# Altium schematic sheet Power_SCH.SchDoc: АСУН-1
size 420 x 297 mm; ApprovedBy: Мешков; CheckedBy: Мешков; Author: Самойлов; CompanyName: РГППУ; DocumentNumber: 2; SheetNumber: 2; SheetTotal: 2; DecimalNumber: ЛТФ.15.01 Э3
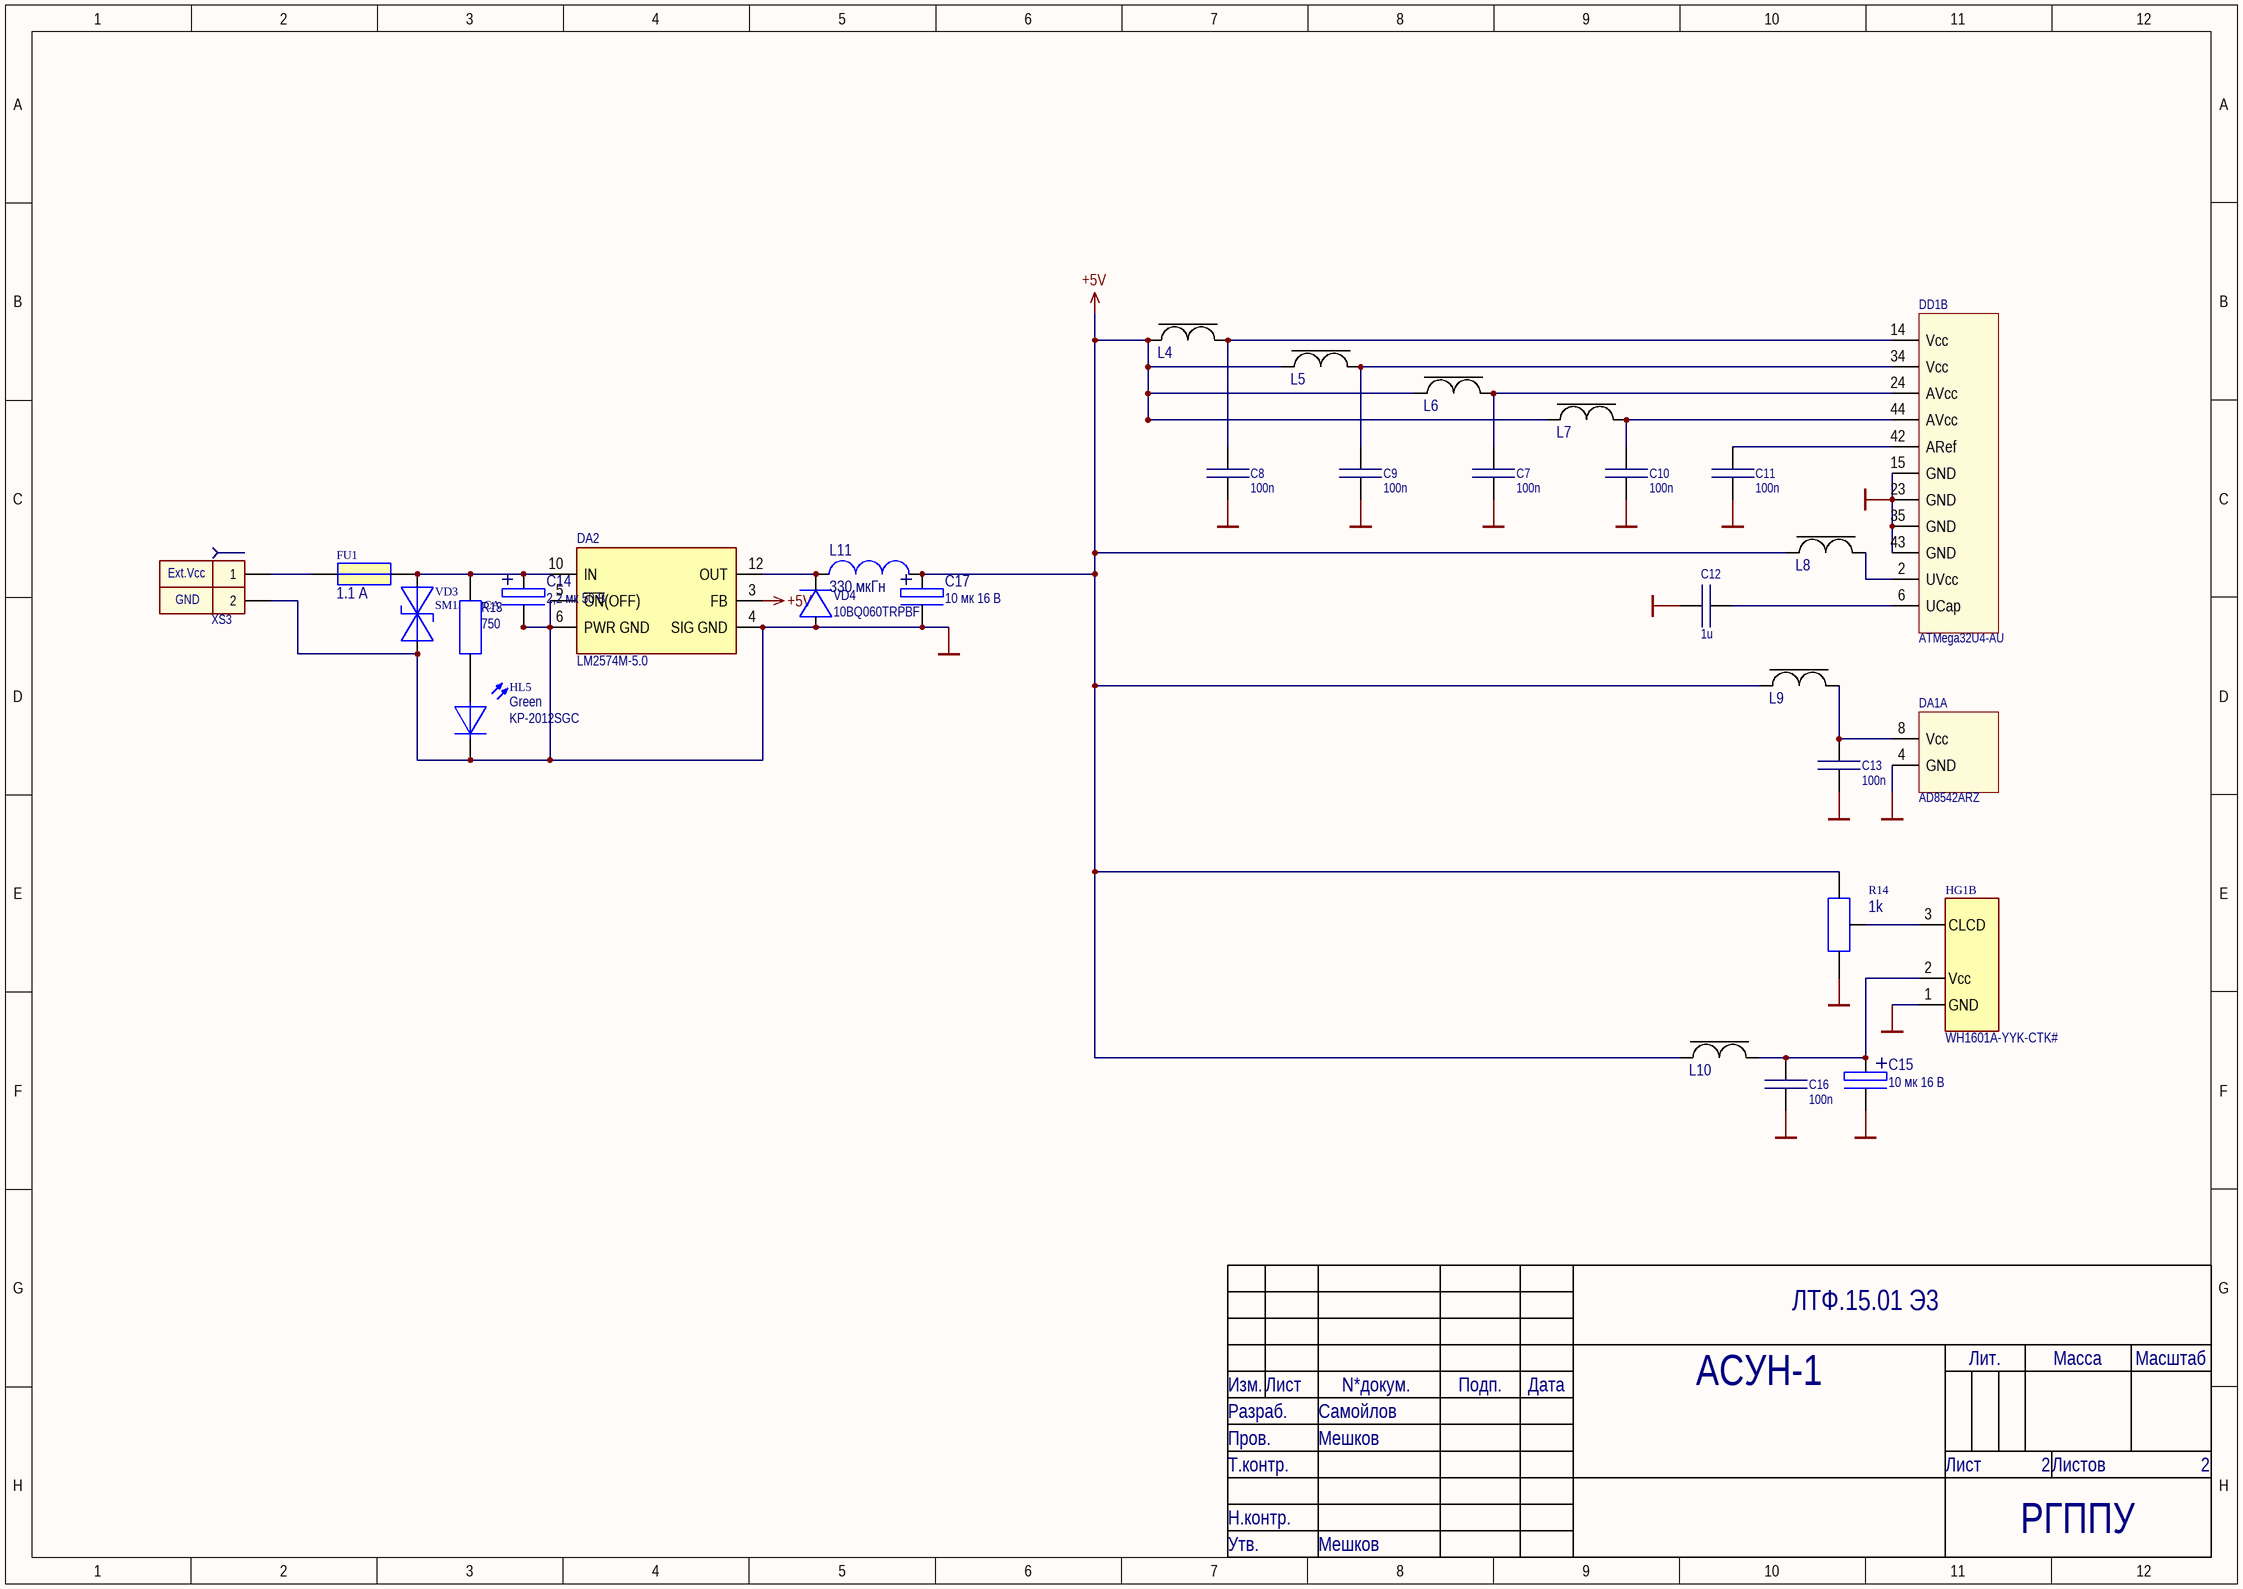
[diagram p0: Power_SCH.SchDoc]

## Parts
C7  100n  [SMDRC0805]
C8  100n  [SMDRC0805]
C9  100n  [SMDRC0805]
C10  100n  [SMDRC0805]
C11  100n  [SMDRC0805]
C12  1u  [SMDRC0805]
C13  100n  [SMDRC0805]
C14  value 2,2 мк 50 В  [CAP_POLAR_ELLYTE_B]  (hidden comment: CA050M2R20REB-0405)
C15  value 10 мк 16 В  [CAP_POLAR_ELLYTE_B]  (hidden comment: CA016M0010REB-0405)
C16  100n  [SMDRC0805]
C17  value 10 мк 16 В  [CAP_POLAR_ELLYTE_B]  (hidden comment: CA016M0010REB-0405)
DA1  AD8542ARZ  [AD8542ARZ]  (part A of 3)
DA2  LM2574M-5.0  [SOIC127P1030X264-14M]
DD1  ATMega32U4-AU  [44ML_L]  (part B of 3)
FU1  value 1.1 А  [EFuse 1.1A]  (hidden comment: EFuse LP60-110F)
HG1  WH1601A-YYK-CTK#  [WH1601A]  (part B of 2)
HL5  Green  ManufacturerPartNumber: KP-2012SGC  [DIOMELF2012M]
L4  MPZ1608S181A  [INDC0603X03M]  (value not drawn)
L5  MPZ1608S181A  [INDC0603X03M]  (value not drawn)
L6  MPZ1608S181A  [INDC0603X03M]  (value not drawn)
L7  MPZ1608S181A  [INDC0603X03M]  (value not drawn)
L8  MPZ1608S181A  [INDC0603X03M]  (value not drawn)
L9  MPZ1608S181A  [INDC0603X03M]  (value not drawn)
L10  MPZ1608S181A  [INDC0603X03M]  (value not drawn)
L11  value 330 мкГн  [INDP7972X50M]  (hidden comment: SCD0705T-331K-N)
R13  750  [SMDRC0805]
R14  value 1k  [T93YA]  (hidden comment: T93YA102KT20)
VD3  SM15T12CA  [SUPRES3216X18N]
VD4  10BQ060TRPBF  [SHOTKY 4.1x3.3]
XS3  330-031-12  [330-031-12]  (value not drawn)

## Nets
+5V: C17.2(+) DA2.3(FB) L4.2 L5.2 L6.2 L7.2 L8.2 L9.1 L10.2 L11.1 R14.3
GND: C7.2 C8.2 C9.2 C10.2 C11.1 C12.2 C13.2 C14.1(-) C15.1(-) C16.2 C17.1(-) DA1.4(GND) DA2.4(SIG_GND) DA2.5(~{ON}(OFF)) DA2.6(PWR_GND) DD1.15(GND) DD1.23(GND) DD1.35(GND) DD1.43(GND) HG1.1(GND) HL5.2 R14.1 VD3.1 VD4.A XS3.2
NetC7_1: C7.1 DD1.24(AVсс) L6.1
NetC8_1: C8.1 DD1.14(Vсс) L4.1
NetC9_1: C9.1 DD1.34(Vсс) L5.1
NetC10_1: C10.1 DD1.44(AVсс) L7.1
NetC11_2: C11.2 DD1.42(ARef)
NetC12_1: C12.1 DD1.6(UCap)
NetC13_1: C13.1 DA1.8(Vcc) L9.2
NetC14_2: C14.2(+) DA2.10(IN) FU1.2 R13.2 VD3.2
NetC15_2: C15.2(+) C16.1 HG1.2(Vcc) L10.1
NetDA2_12: DA2.12(OUT) L11.2 VD4.K
NetDD1_2: DD1.2(UVcc) L8.1
NetFU1_1: FU1.1 XS3.1
NetHG1_3: HG1.3(CLCD) R14.2
NetHL5_1: HL5.1 R13.1

## Notes on the sheet
- (near XS3) Ext.Vcc
- (near XS3) GND
- Изм.
- Лист
- N*докум.
- Подп.
- Дата
- Лит.
- Масса
- Масштаб
- Разраб.
- Пров.
- Т.контр.
- Лиcт
- Лиcтов
- Н.контр.
- Утв.

## Library data of the parts
C7-C11 C13 C16 = Capacitor 0805 100n: Generic capasitor non-polar; PartNumber: Capacitor 0805 100n; Value: 100n; ComponentLink1Description: Datasheet; Package: 0805
C12 = Capacitor 0805 1u: Generic capasitor non-polar; PartNumber: Capacitor 0805 1u; Value: 1u; ComponentLink1Description: Datasheet; Package: 0805
C14 = 02200_050: 2,2uF 50V Polar capacitor; Manufacturer: Yageo; ManufacturerPartNumber: CA050M2R20REB-0405; Supplier: Промэлектроника; Cost: 4,11; Package: not standard; ComponentLink1Description: Datasheet; ComponentLink1URL: http://www.yageo.com/documents/recent/E-Cap_SurfaceMount_CA_2011.pdf; ComponentLink2Description: Datasheet-local; ComponentLink2URL: *
C15 C17 = 10000_016: 10uF 16V Polar SMD cap; Manufacturer: YAGEO; ManufacturerPartNumber: CA016M0010REB-0405; Supplier: -; Cost: 3,03; Package: штырьевой; ComponentLink1Description: Datasheet; ComponentLink2Description: Datasheet-local
DD1 = ATMega32U4: ManufacturerPartNumber: ATMega32U4-AU
FU1 = EFuse LP60-110F: Fuse; ManufacturerPartNumber: EFuse LP60-110F; ComponentLink1Description: Datasheet; ComponentLink2Description: Datasheet-local; ComponentLink2URL: *
HG1 = LCD 1601A: Liquid crystal display; Manufacturer: Winstar; ComponentLink1URL: http://www.promelec.ru/pdf/wh1602l.pdf; ComponentLink1Description: Datasheet; ComponentLink2Description: Datasheet-local; ComponentLink2URL: *; ManufacturerPartNumber: WH1601A-YYK-CTK#
HL5 = LED1_G: Diod LED SMD Green; ComponentLink1Description: Datasheet; Cost: 2,88; ComponentLink2Description: Datasheet-local; ComponentLink2URL: *; Color: Green
L4-L10 = Ferrite Bead: Value: ? мГн; ManufacturerPartNumber: MPZ1608S181A; ComponentLink1Description: Datasheet; Supplier: Промэлектроника; ComponentLink2Description: Datasheet-local; ComponentLink2URL: *
L11 = SCD0705T-331K-N: Inductor; ManufacturerPartNumber: SCD0705T-331K-N; ComponentLink1Description: Datasheet; ComponentLink1URL: http://download.siliconexpert.com/pdfs/2010/12/8/6/47/4/732/yageo_/manual/inductors_smdpower_scd_2010.pdf; ComponentLink2Description: Datasheet-local; ComponentLink2URL: *
R13 = Resistor 0805 750: Generic resistor; PartNumber: Resistor 0805 750; Value: 750; ComponentLink1URL: http://www.mouser.com/ds/2/447/PYu-RC0402_51_RoHS_L_6_r-8721.pdf; ComponentLink1Description: Datasheet; Package: 0805
R14 = Res trim_1k: Resistor trimming; Manufacturer: VISHAY; ManufacturerPartNumber: T93YA102KT20; ComponentLink1Description: Datasheet; ComponentLink1URL: http://www.vishay.com/docs/51026/t93.pdf; Cost: 38.41; Package: not standard; ComponentLink2Description: Datasheet-local; ComponentLink2URL: *
VD3 = SM15T12CA: Diod suppressor; Manufacturer: ST Microelectronics; Notes: 12 В; ComponentLink1Description: Datasheet; ComponentLink1URL: http://www.st.com/st-web-ui/static/active/en/resource/technical/document/datasheet/CD00000724.pdf; Cost: 16,73; Package: SMC/DO-214AB; Supplier: Промэлектроника; ComponentLink2Description: Datasheet-local; ComponentLink2URL: *; ManufacturerPartNumber: SM15T12CA
VD4 = 10BQ060TRPBF: DIODE SCHOTTKY 60V 1A DO214AA; Manufacturer: Vishay Semiconductor Diodes Division; Voltage - Forward (Vf) (Max) @ If: 600mV @ 1A; Current - Reverse Leakage @ Vr: 100µA @ 60V; Category: Discrete Semiconductor Products; Diode Type: Schottky; Voltage - DC Reverse (Vr) (Max): 60V; Current - Average Rectified (Io): 1A; Reverse Recovery Time (trr): -; Mounting Type: Surface Mount; Package / Case: DO-214AA, SMB; Operating Temperature - Junction: -55°C ~ 150°C; ComponentLink1URL: http://www.vishay.com/docs/94113/vs-10bq060pbf.pdf; ComponentLink1Description: http://www.vishay.com/docs/94113/vs-10bq060pbf.pdf; ManufacturerPartNumber: 10BQ060TRPBF
DA1 = AD8542ARZ: ManufacturerPartNumber: AD8542ARZ
DA2 = LM2574M-5.0: ManufacturerPartNumber: LM2574M-5.0
XS3 = 330-031-12: ManufacturerPartNumber: 330-031-12